# Altium schematic sheet Cover Page (2).SchDoc: Cover Page/Kapak Sayfası
size A3; Author: Utku Anıl Anıl; CompanyName: ANOVA Ar-Ge Teknolojileri; DrawnBy: Utku Anıl Altın; DocumentNumber: 102903-001; Revision: 01; SheetNumber: 1; SheetTotal: 2; AAuthor: Utku Anıl Altın; DocumentNo: 102903-001; ProjectNo: ANV20-28; RevisionNo: 01; SheetSize: A3; DesignedBy: Utku Anıl Altın; DrawnDate: 18.08.2021; DesignDate: 18.08.2021; Document_Name: PERMATS Power Management Schematics; LastCheckDate: 18.08.2021; Parameter 3: 01
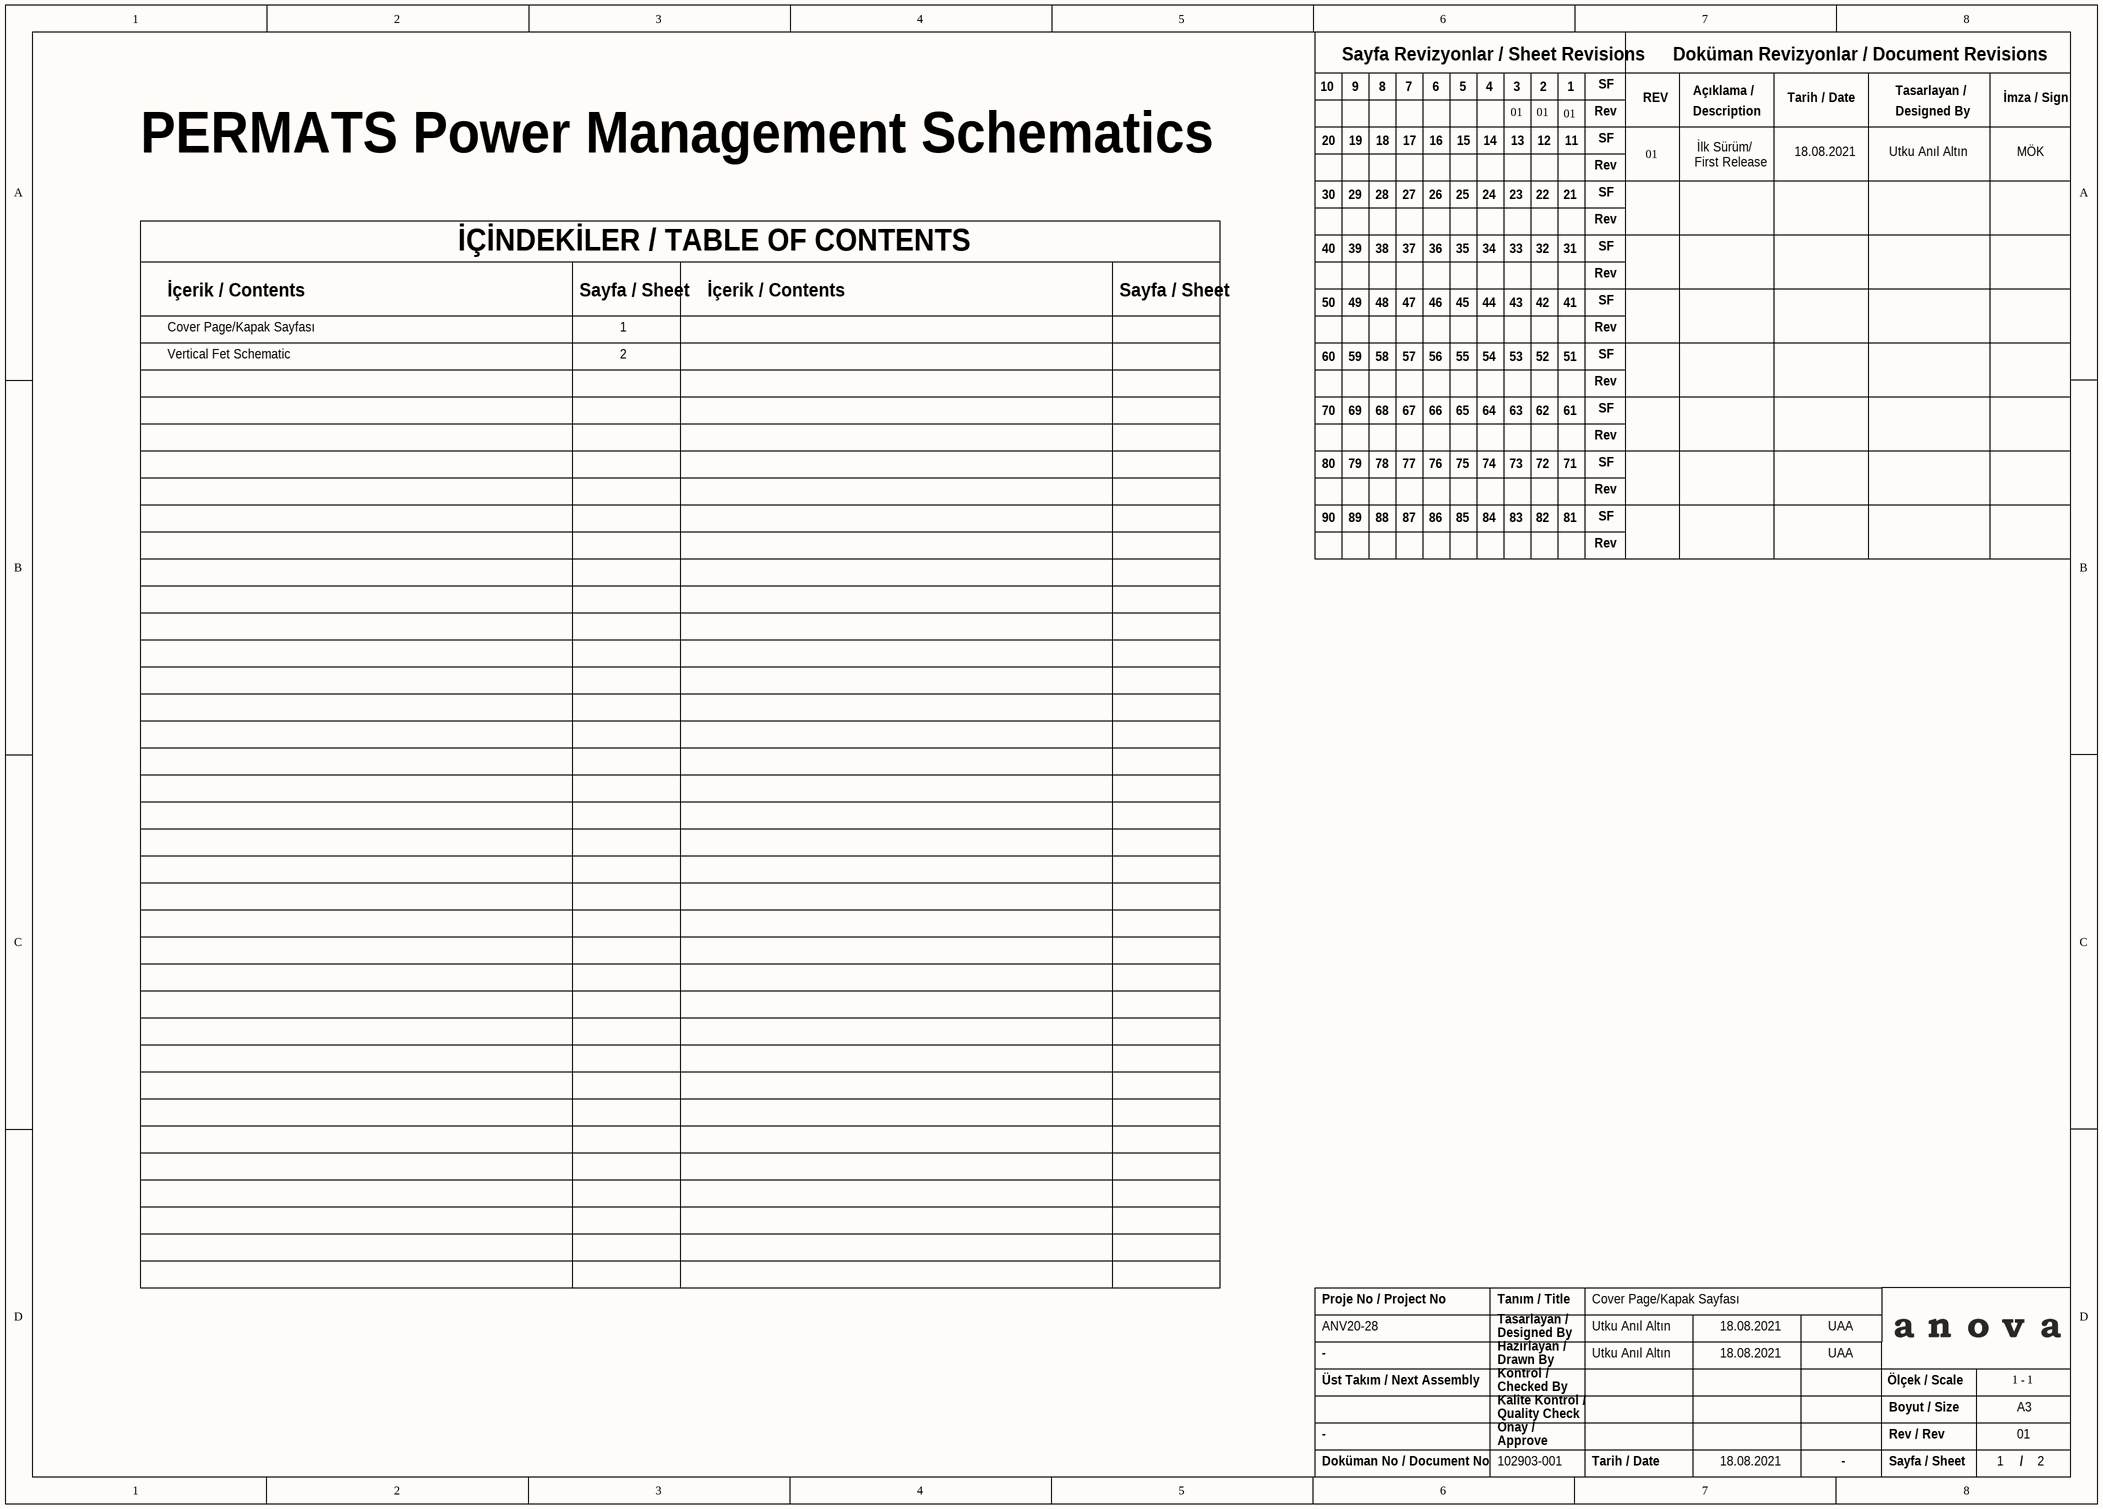
[diagram p0: Cover Page (2).SchDoc]

## Notes on the sheet
- 01
- First Release
- İlk Sürüm/
- MÖK
- Vertical Fet Schematic
- Cover Page/Kapak Sayfası
- 1
- 2
- UAA
- 1   1
- 10
- Sayfa Revizyonlar / Sheet Revisions
- 9
- 8
- 7
- 6
- 5
- 4
- 3
- SF
- REV
- Doküman Revizyonlar / Document Revisions
- Açıklama /
- Tarih / Date
- Tasarlayan /
- İmza / Sign
- 20
- 19
- 18
- 17
- 16
- 15
- 14
- 13
- 12
- 11
- Rev
- Description
- Designed By
- 30
- 29
- 28
- 27
- 26
- 25
- 24
- 23
- 22
- 21
- İçerik / Contents
- İÇİNDEKİLER / TABLE OF CONTENTS
- Sayfa / Sheet
- 40
- 50
- 39
- 49
- 38
- 48
- 37
- 47
- 36
- 46
- 35
- 45
- 34
- 44
- 33
- 43
- 32
- 42
- 31
- 41
- 60
- 59
- 58
- 57
- 56
- 55
- 54
- 53
- 52
- 51
- 70
- 69
- 68
- 67
- 66
- 65
- 64
- 63
- 62
- 61
- 80
- 79
- 78
- 77
- 76
- 75
- 74
- 73
- 72
- 71
- 90
- 89
- 88
- 87
- 86
- 85
- 84
- 83
- 82
- 81
- Proje No / Project No
- Tanım / Title
- Üst Takım / Next Assembly
- -
- Hazırlayan /
- Kontrol /
- Drawn By
- Checked By
- Ölçek / Scale
- Kalite Kontrol /
- Quality Check
- Onay /
- Approve
- Boyut / Size
- Rev / Rev
- A3
- Doküman No / Document No
- /